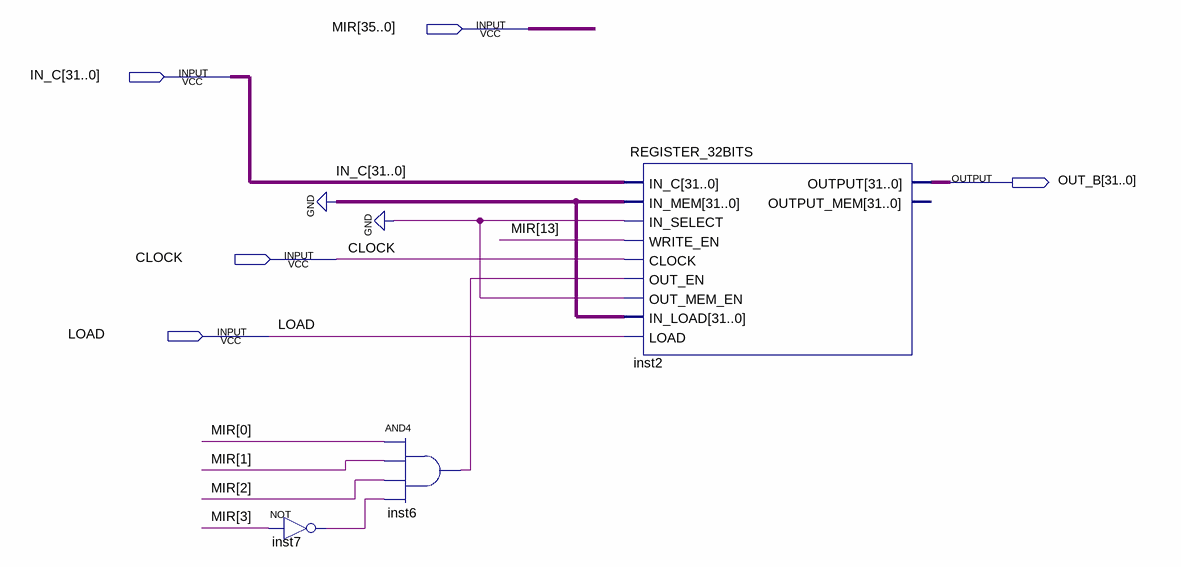
[diagram p0: schematic sheet]
// Quartus schematic TOS.bdf as structural Verilog: 3 symbols, 5 pins
module TOS (
  input  [35:0] MIR,
  input  [31:0] IN_C,
  input  CLOCK,
  input  LOAD,
  output [31:0] OUT_B
);

  wire inst6_out, inst7_out;

  not inst7 (inst7_out, MIR[3]);
  and inst6 (inst6_out, MIR[0], MIR[1], MIR[2], inst7_out);
  REGISTER_32BITS inst2 (
    .IN_C(IN_C), .IN_MEM({32{1'b0}}), .IN_SELECT(1'b0), .WRITE_EN(MIR[13]), .CLOCK(CLOCK),
    .OUT_EN(inst6_out), .OUT_MEM_EN(1'b0), .IN_LOAD({32{1'b0}}), .LOAD(LOAD), .OUTPUT(OUT_B));  // open: OUTPUT_MEM
endmodule
